# Altium project PCB_Project_3.PrjPcb
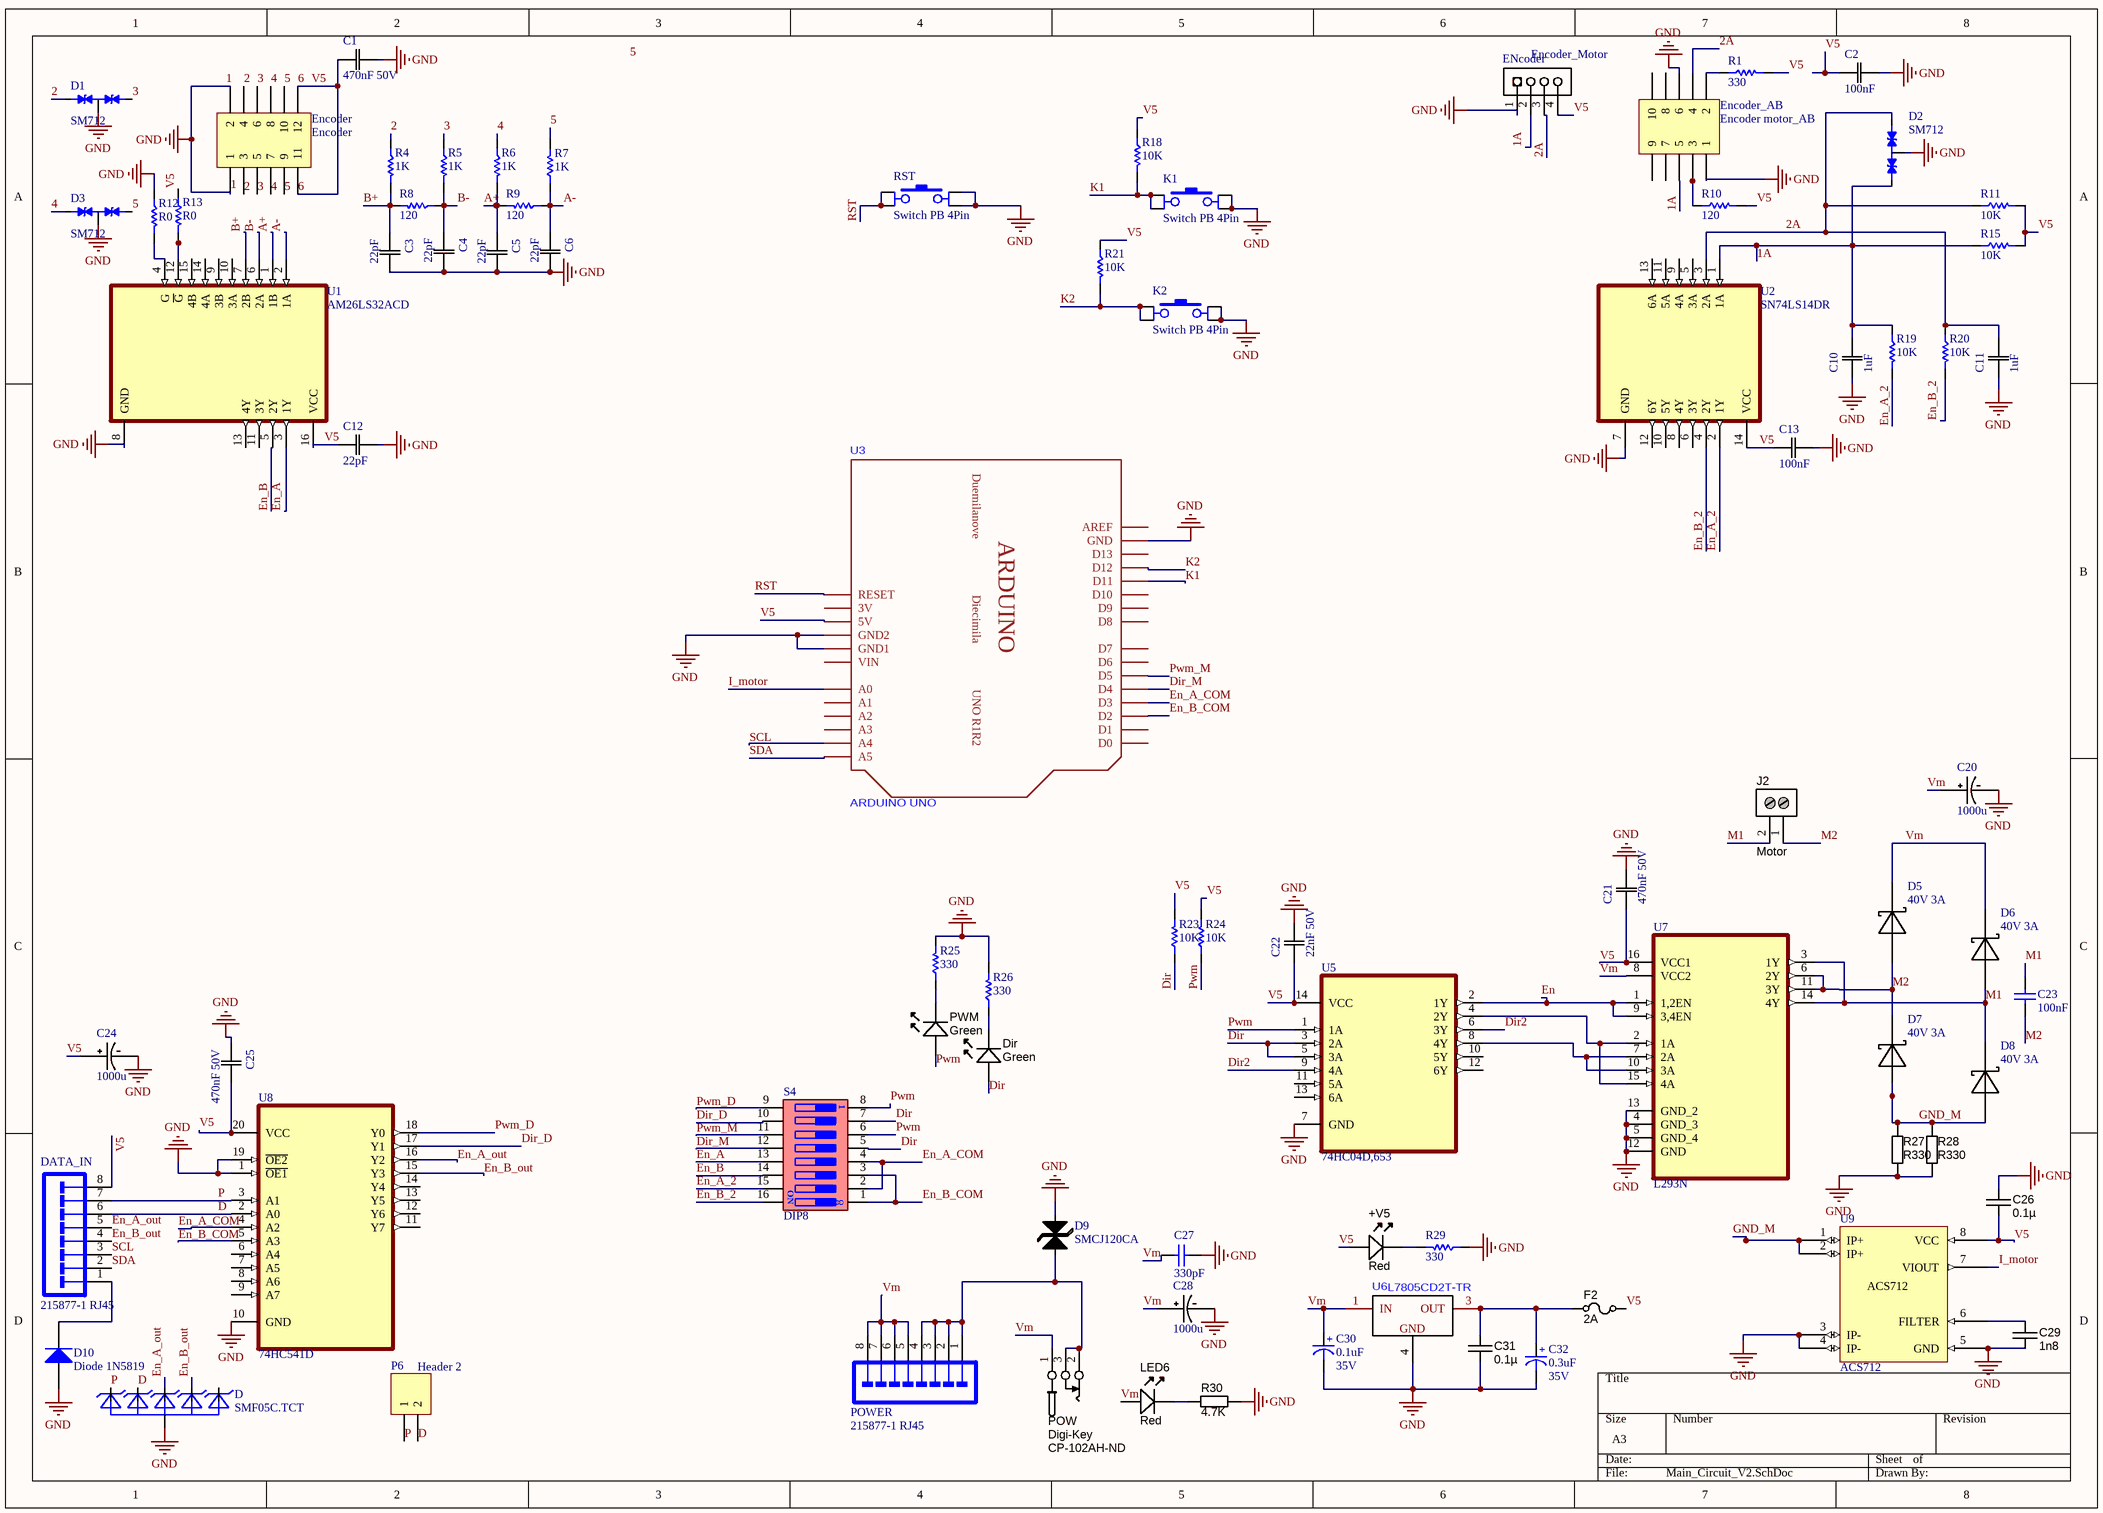
[diagram p0: Main_Circuit_V2.SchDoc]
1 sheet, 82 parts. Net scope: global (net labels, ports and power ports of the same name join across sheets).
Board file: PCB1_V2.PcbDoc

## Sheet Main_Circuit_V2.SchDoc
size A3

### Parts
(Parts that share a designator on the sheet are numbered #1, #2 ... from top to bottom, then left to right.)
+V5  Color: Red  [LED-0805-K]
C1  470nF 50V  [0805]
C2  100nF  [0805]
C3  22pF  [0805]
C4  22pF  [0805]
C5  22pF  [0805]
C6  22pF  [0805]
C10  1uF  [0805]
C11  1uF  [0805]
C12  22pF  [0805]
C13  100nF  [0805]
C20  1000u  [RADIAL - THRU 5mm]
C21  470nF 50V  [0805]
C22  22nF 50V  [0805]
C23  100nF  [CAP Ceramic 3.5mm]
C24  1000u  [RADIAL - THRU 5mm]
C25  470nF 50V  [0805]
C26  value 0.1µ  [CAPC2012X135N]  (hidden comment: approved sub OK)
C27  330pF  [CAP Ceramic 3.5mm]
C28  1000u  [RADIAL - THRU 5mm]
C29  value 1n8  [CAPC2012X135N]  (hidden comment: approved sub OK)
C30  Voltage: 35V  [CAPR5-4X5]  (hidden comment: 0.1uF)
C31  value 0.1µ  [CAPC2012X135N]  (hidden comment: approved sub OK)
C32  Voltage: 35V  [cap 00]  (hidden comment: 0.3uF)
D  SMF05C.TCT  [SC70-6]
D1  SM712  [PCBComponent_1]
D2  SM712  [PCBComponent_1]
D3  SM712  [PCBComponent_1]
D5  40V 3A  [DO-214AC]
D6  40V 3A  [DO-214AC]
D7  40V 3A  [DO-214AC]
D8  40V 3A  [DO-214AC]
D9  SMCJ120CA  [DIODE-SMC]
D10  Diode 1N5819  [DO-214AC]
DATA_IN  215877-1 RJ45  [rj45]
Dir  Color: Green  [LED-0805-K]
ENcoder#1  Encoder_Motor  [HEADER-1X4]
Encoder#2  Encoder  [HDR2X6]
Encoder_AB  Encoder motor_AB  [hhh]
F2  value 2A  [RESC3216X70N]  (hidden comment: Slow-blow)
J2  Supplier Part Number 1: Motor  [2P_PCB_ScrewTerm_90S_3.81MM]  (hidden comment: Stackable ScrewTerm)
K1  Switch PB 4Pin  [SW_PB_THT_4PIN_SPDT_6X6X7]
K2  Switch PB 4Pin  [SW_PB_THT_4PIN_SPDT_6X6X7]
LED6  Color: Red  [LED-0805-K]
P6  Header 2  [HDR1X2]
POW  Supplier 1: Digi-Key  Supplier Part Number 1: CP-102AH-ND  [CONN_PWR_JACK_2.1x5.5mm]  (hidden comment: CONN_PWR_JACK_2.1x5.5mm)
POWER  215877-1 RJ45  [rj45]
PWM  Color: Green  [LED-0805-K]
R1  330  [0805]
R4  1K  [0805]
R5  1K  [0805]
R6  1K  [0805]
R7  1K  [0805]
R8  120  [0805]
R9  120  [0805]
R10  120  [0805]
R11  10K  [0805]
R12  R0  [0805]
R13  R0  [0805]
R15  10K  [0805]
R18  10K  [0805]
R19  10K  [0805]
R20  10K  [0805]
R21  10K  [0805]
R23  10K  [0805]
R24  10K  [0805]
R25  330  [0805]
R26  330  [0805]
R27  value R330  [RESC6332X70N]  (hidden comment: Thick Film)
R28  value R330  [RESC6332X70N]  (hidden comment: Thick Film)
R29  330  [0805]
R30  value 4.7K  [RESC3216X70N]  (hidden comment: Thin Film)
RST  Switch PB 4Pin  [SW_PB_THT_4PIN_SPDT_6X6X7]
S4  DIP8  [DIP Switch x8]
U1  AM26LS32ACD  [SOIC127P600X175-16N]
U2  SN74LS14DR  [SOIC127P600X175-14N]
U3  ARDUINO UNO  [Ardu_Uno]
U5  74HC04D,653  [SOIC127P600X175-14N]
U6  L7805CD2T-TR  [TO-252]
U7  L293N  [DIP254P762X508-16]
U8  74HC541D  [SOIC20-1]
U9  ACS712  [ACS712]

### Nets
1: C1.2(C2) C2.2(C2) C3.2(C2) C4.2(C2) C5.2(C2) C6.2(C2) C10.1(C1) C11.1(C1) C12.2(C2) C13.2(C2) C20.NEG C21.2(C2) C22.2(C2) C24.NEG C25.1(C1) C26.1 C27.1 C28.NEG C29.2 C30.2(-) C31.2 C32.2(-) D.2(A) D1.3 D2.3 D3.3 D9.K D10.1(A) ENcoder#1.1 Encoder#2.1 Encoder#2.2 Encoder_AB.1 Encoder_AB.6 K1.3(PINB2) K1.4(PINB1) K2.3(PINB2) K2.4(PINB1) R12.1 R25.2 R26.2 R27.2 R28.2 R29.1 R30.2 RST.3(PINB2) RST.4(PINB1) U1.8(GND) U2.7(GND) U3.GND U3.GND1 U3.GND2 U5.7(GND) U6.4(GND) U7.4(GND_3) U7.5(GND_4) U7.12(GND) U7.13(GND_2) U8.1(~{OE1}) U8.10(GND) U8.19(~{OE2}) U9.3(IP-) U9.4(IP-) U9.5(GND)  [also labelled GND]
1A: C10.2(C2) D2.2 ENcoder#1.2 Encoder_AB.5 R15.1 R19.1 U2.1(1A)
2: D1.2 Encoder#2.3 Encoder#2.4 R4.1
2A: C11.2(C2) D2.1 ENcoder#1.3 Encoder_AB.4 R11.1 R20.1 U2.3(2A)
3: D1.1 Encoder#2.5 Encoder#2.6 R5.1
4: D3.2 Encoder#2.7 Encoder#2.8 R6.1
5: D3.1 Encoder#2.9 Encoder#2.10 R7.2
6: +V5.A C1.1(C1) C2.1(C1) C12.1(C1) C13.1(C1) C21.1(C1) C22.1(C1) C24.POS C25.2(C2) C26.2 DATA_IN.8 ENcoder#1.4 Encoder#2.11 Encoder#2.12 F2.2 R1.2 R10.2 R13.1 R18.1 R21.1 R23.2 R24.2 U1.16(VCC) U2.14(VCC) U3.5V U5.14(VCC) U7.16(VCC1) U8.20(VCC) U9.8(VCC)  [also labelled V5]
A+: C5.1(C1) R6.2 R9.2 U1.1(1B)
A-: C6.1(C1) R7.1 R9.1 U1.2(1A)
B+: C3.1(C1) R4.2 R8.2 U1.7(2B)
B-: C4.1(C1) R5.2 R8.1 U1.6(2A)
D: D.3(C2) DATA_IN.6 P6.2 U8.2(A0)
Dir: Dir.A R23.1 S4.5 S4.7 U5.3(2A) U5.5(3A)
Dir2: U5.6(3Y) U5.9(4A)
Dir_D: S4.10 U8.17(Y1)
Dir_M: S4.12 U3.D4
En: U5.2(1Y) U7.1(1,2EN) U7.9(3,4EN)
En_A: S4.13 U1.3(1Y)
En_A_2: R19.2 S4.15 U2.2(1Y)
En_A_COM: S4.2 S4.4 U3.D3 U8.4(A2)
En_A_out: D.4(C3) DATA_IN.5 U8.16(Y2)
En_B: S4.14 U1.5(2Y)
En_B_2: R20.2 S4.16 U2.4(2Y)
En_B_COM: S4.1 S4.3 U3.D2 U8.5(A3)
En_B_out: D.5(C4) DATA_IN.4 U8.15(Y3)
GND_M: D7.A D8.A R27.1 R28.1 U9.1(IP+) U9.2(IP+)
I_motor: U3.A0 U9.7(VIOUT)
K1: K1.1(PINA1) K1.2(PINA2) R18.2 U3.D11
K2: K2.1(PINA1) K2.2(PINA2) R21.2 U3.D12
M1: C23.2 D6.A D8.C(K) J2.2 U7.3(1Y) U7.14(4Y)
M2: C23.1 D5.A D7.C(K) J2.1 U7.6(2Y) U7.11(3Y)
P: D.1(C1) DATA_IN.7 P6.1 U8.3(A1)
Pwm: PWM.A R24.1 S4.6 S4.8 U5.1(1A)
Pwm_D: S4.9 U8.18(Y0)
Pwm_M: S4.11 U3.D5
RST: RST.1(PINA1) RST.2(PINA2) U3.RESET
SCL: DATA_IN.3 U3.A4
SDA: DATA_IN.2 U3.A5
Vm: C20.POS C27.2 C28.POS C30.1(+) D5.C(K) D6.C(K) LED6.A POW.1 POWER.5 POWER.6 POWER.7 POWER.8 U6.1(IN) U7.8(VCC2)
Net+V5_K: +V5.K R29.2
NetC29_1: C29.1 U9.6(FILTER)
NetC31_1: C31.1 C32.1(+) F2.1 U6.3(OUT)
NetD9_A: D9.A POW.2 POW.3 POWER.1 POWER.2 POWER.3 POWER.4
NetD10_2: D10.2(K) DATA_IN.1
NetDir_K: Dir.K R26.1
NetEncoder_AB_2: Encoder_AB.2 R1.1
NetEncoder_AB_3: Encoder_AB.3 R10.1
NetLED6_K: LED6.K R30.1
NetPWM_K: PWM.K R25.1
NetR12_2: R12.2 U1.4(G)
NetR13_2: R13.2 U1.12(~{G})
NetU5_4: U5.4(2Y) U7.2(1A) U7.15(4A)
NetU5_8: U5.8(4Y) U7.7(2A) U7.10(3A)

Not connected (* = marked no-connect by the designer): D 6(C5); Encoder_AB 7 8 9 10; R11 2; R15 2; U1 9(3B) 10(3A) 11(3Y) 13(4Y) 14(4A) 15(4B); U2 5(3A) 6(3Y) 8(4Y) 9(4A) 10(5Y) 11(5A) 12(6Y) 13(6A); U3 3V A1 A2 A3 AREF D0 D1 D6 D7 D8 D9 D10 D13 VIN; U5 10(5Y) 11(5A) 12(6Y) 13(6A); U8 6(A4) 7(A5) 8(A6) 9(A7) 11(Y7) 12(Y6) 13(Y5) 14(Y4)

### Notes on the sheet
- Labels drawn without touching a wire or pin: 5
- (in symbol ARDUINO UNO) Duemilanove; ARDUINO; Diecimila; UNO R1R2
- (in symbol DIP Switch 8) ON

### Library data of the parts
+V5 = LED_SMD_Red_0805_6mcd: LED 0805 SMD Red 6mcd 621nm; Manufacturer 1: Lite-On Inc; Manufacturer Part Number 1: LTST-C171EKT; Ratings: 6 mcd; 621 nm; SCDType: source; Package / Case: 0805; Material: GaAsP on GaP; Supplier 1: Digi-Key; Supplier Part Number 1: 160-1422-1-ND; Value: Red
C1 C21 C25 = CAP 470nF 50V: CAP CER 0.1UF 50V X7R 0805; Tolerance: 10%; Package: 0805; Value: 470nF; Rating: 50V
C2-C6 C10-C13 C22 = CAP 470nF 50V: CAP CER 0.1UF 50V X7R 0805; Value: 470nF; Tolerance: 10%; Package: 0805; Rating: 50V
C20 C24 C28 = CAP POL 1000uF TH: NICHICON   UVR1E102MPD1TD   ALUMINUM ELECTROLYTIC CAPACITOR, 1000UF, 25V, 20%, RADIAL, FULL REEL; Dielectric Material: Aluminium; Life (Hours): 2000Hour; Capacitance: 1mF; Leakage Current: 750uA; Dissipation Factor: 0.16%; Ripple Current: 960mA; Lead Diameter: 0.6mm; Supplier 1: Digi-Key; Manufacturer: Nichicon; Manufacturer Part Number: UVR1E102MPD1TD; RoHS: Yes; Category: Aluminum Electrolytic Capacitors; Stock 1: 43448; Pricing 1: 1=0.58000, 10=0.40800, 100=0.26890 (USD); Mount: Through Hole,PCB; Case/Package: Radial; Number of Pins: 2; Min Operating Temperature: -40°C; Max Operating Temperature: 85°C; Packaging: Tape and Reel; Tolerance: 20%; Voltage Rating (DC): 25V; Voltage Rating: 25V; Termination: Radial; Voltage: 25V; Package Quantity: 500; Diameter: 10mm; Length: 20mm; Height: 20mm; Height - Seated (Max): 0.866inch; Lead Pitch: 5mm; Radiation Hardening: No; REACH SVHC: No SVHC; Lead Free: Lead Free; ComponentLink1URL: https://datasheet.ciiva.com/7851/e-vr-7851718.pdf?src-supplier=Element14; ComponentLink1Description: https://datasheet.ciiva.com/7851/e-vr-7851718.pdf?src-supplier=Element14; ComponentLink2URL: https://datasheet.ciiva.com/6300/e-vr-6300009.pdf?src-supplier=Digi-Key; ComponentLink2Description: https://datasheet.ciiva.com/6300/e-vr-6300009.pdf?src-supplier=Digi-Key; ComponentLink3URL: https://datasheet.ciiva.com/6300/e-vr-6300010.pdf?src-supplier=Digi-Key; ComponentLink3Description: https://datasheet.ciiva.com/6300/e-vr-6300010.pdf?src-supplier=Digi-Key; ComponentLink4URL: https://datasheet.ciiva.com/11684/e-vr-11684106.pdf?src-supplier=Avnet; ComponentLink4Description: https://datasheet.ciiva.com/11684/e-vr-11684106.pdf?src-supplier=Avnet; ComponentLink5URL: https://datasheet.ciiva.com/16502/e-vr-16502813.pdf?src-supplier=Future+Electronics; ComponentLink5Description: https://datasheet.ciiva.com/16502/e-vr-16502813.pdf?src-supplier=Future+Electronics; ComponentLink6URL: https://datasheet.ciiva.com/46381/1909356-46381757.pdf?src-supplier=Element14; ComponentLink6Description: https://datasheet.ciiva.com/46381/1909356-46381757.pdf?src-supplier=Element14; Supplier Part Number 1: 493-5913-1-ND
C23 C27 = CAP CERAMIC TOTAL SIZE: CAP Ceramic Total; Designer: Ali Hafizi
C26 C31 = CAPC_1u_0805_X7R_16V_10%: Capacitor SMD Cer 1uF 10% 16V X7R 0805; Manufacturer 1: Yageo; Manufacturer Part Number 1: CC0805KKX7R7BB105; Ratings: 16V; X7R; Material: ceramic; SCDType: spec; Package / Case: 0805 (2012 metric); Tolerance: ±10%; Supplier 1: Digi-Key; Supplier Part Number 1: 311-1365-6-ND; RoHS 1: RoHS Compliant; Temperature Coefficient: X7R; ComponentLink1URL: http://www.yageo.com/documents/recent/UPY-GPHC_X7R_6.3V-to-50V_8.pdf; ComponentLink1Description: http://www.yageo.com/documents/recent/UPY-GPHC_X7R_6.3V-to-50V_8.pdf; Supplier 2: Digi-Key; Supplier Part Number 2: 399-1284-6-ND; Manufacturer 2: Kemet; Manufacturer Part Number 2: C0805C105K4RACTU; RoHS 2: RoHS Compliant; ComponentLink2URL: http://www.kemet.com/datasheets&C0805C105K4RACTU; ComponentLink2Description: http://www.kemet.com/datasheets&C0805C105K4RACTU; Supplier 3: Digi-Key; Supplier Part Number 3: 1276-1026-6-ND; Manufacturer 3: Samsung Electro-Mechanics America, Inc; Manufacturer Part Number 3: CL21B105KOFNNNE; RoHS 3: RoHS Compliant; ComponentLink3URL: http://www.samsungsem.com/servlet/FileDownload?type=spec&file=CL21B105KOFNNNE.pdf; ComponentLink3Description: http://www.samsungsem.com/servlet/FileDownload?type=spec&file=CL21B105KOFNNNE.pdf; Supplier 4: Digi-Key; Supplier Part Number 4: 445-1358-6-ND; Manufacturer 4: TDK Corporation; Manufacturer Part Number 4: C2012X7R1C105K125AA; RoHS 4: RoHS Compliant; ComponentLink4URL: http://product.tdk.com/capacitor/mlcc/en/documents/mlcc_commercial_general_en.pdf; ComponentLink4Description: http://product.tdk.com/capacitor/mlcc/en/documents/mlcc_commercial_general_en.pdf
C29 = CAPC_1n8_50V_0805: Capacitor SMD Cer 1.8nF 10% 50V X7R 0805; Manufacturer 1: AVX Corporation; Manufacturer Part Number 1: 08055C182KAT2A; Ratings: 50V; X7R; SCDType: source*; Tolerance: ±10%; Operating Temperature: -55°C ~ 125°C; Package / Case: 0805 (2012 metric); Supplier 1: Digi-Key; Supplier Part Number 1: 478-1374-1-ND
C30 C32 = Cap-Polar: Polar Capacitor; Designer: Saeid Jorablo; Organazation: ControTec; Adding Date: 1387/12/20
  C30: Value: 0.1uF
  C32: Value: 0.3uF
D = SMF05C.TCT: 12.5V Clamp 8A _8/20Âµs_ Ipp Tvs Diode Surface Mount SC-70-6; MF: Semtech; Price: None; Value: *; MP: SMF05C.TCT; Package: SOT-363 Diodes Inc.; SnapEDA_Link: https://www.snapeda.com/parts/SMF05C.TCT/Semtech%20Corporation/view-part/1264306/?ref=snap; Availability: Unavailable
D1-D3 = SM712.TC: Asymmetrical TVS Diode for  Extended Common-Mode RS-485; Manufacturer: SEMTECH; Link to Datasheet: *; Link to Picture: *; Operating Temp: -55 to 125 °C; Storage Temp: -55 to 150 °C; ComponentLink1Description: *; ComponentLink1URL: *; Manufacture Part #: SM712.TC; Value: SM712
D5-D8 = DIODE SCHOTTKY 40V 3A: Diode Schottky 40V 3A Surface Mount SMA; Voltage - Forward (Vf) (Max) @ If: 450mV @ 3A; ComponentLink1Description: digikey; ComponentLink1URL: https://www.digikey.ca/product-detail/en/on-semiconductor/MBR0540T1G/MBR0540T1GOSCT-ND/917967; Voltage - DC Reverse (Vr) (Max): 40V; Package: DO-214AC; Current - Average Rectified (Io): 3A
D9 = SMCJ120CA: Transient Surpression Diode TVS; Supplier 1: Digi-Key; Supplier Part Number 1: SMCJ120CABTR-ND
D10 = Diode 1N5819: SS14; ComponentLink1Description: Manufacturer Link; ComponentLink1URL: http://www.irf.com/
DATA_IN POWER = 215877-1 RJ45: Female Header, Pitch 2.54 mm, 2 x 4 Position, Height 11.5 mm, Tail Length 3 mm, -40 to 105 degC, RoHS, Tape and Reel; Dynamic Catalog: Modular Jacks; Other Names: A105009CT; Number of Ports: 1; Connector Type: Jack; LED Color: Does Not Contain LED; Ratings: Cat3; Number of Positions/Contacts: 8p8c (RJ45, Ethernet); 3D Model: 215877-1.pdf; Tab Direction: Down; Shielding: Unshielded; DatasheetVersion: Rev. AE; PackageReference: THD; Supplier 1: Digi-Key; Supplier Part Number 1: A105009TR-ND; Supplier 2: Digi-Key; Supplier Part Number 2: A105009CT-ND; Features: Board Lock; Packaging: Cut Tape (CT); Termination: Solder; Family: Modular Connectors - Jacks; Contact Finish: Gold; Housing Material: Polybutylene Terephthalate (PBT); RoHS Information: 215877-1 Statement of Compliance; Mounting Type: Through Hole; Contact Material: Phosphor Bronze; Orientation: 90° Angle (Right); Standard Package: 1; Number of Rows: 1; Category: Connectors, Interconnects; ComponentLink1Description: Manufacturer URL; ComponentLink1URL: http://www.te.com; ComponentLink2Description: Datasheet; ComponentLink2URL: https://datasheet.ciiva.com/16310/215877-1-16310656.pdf
Dir PWM = LED_SMD_Green_0805_6mcd: LED, 0805 SMD, Green; Manufacturer 1: LITE-ON; Manufacturer Part Number 1: LTST-C171GKT; Ratings: 6 mcd; 569 nm; SCDType: source; Package / Case: 0805; Material: GaP; Supplier 1: Digi-Key; Supplier Part Number 1: 160-1423-1-ND; Value: Green
ENcoder#1 = HEADER-1X4: Supplier 1: Digi-Key; Supplier Part Number 1: S1011E-36-ND
Encoder#2 = Header 6X2: Header, 6-Pin, Dual row; LatestRevisionDate: 17-Jul-2002; LatestRevisionNote: Re-released for DXP Platform.; Publisher: Altium Limited
Encoder_AB = Header 5X2: Header, 5-Pin, Dual row; LatestRevisionDate: 17-Jul-2002; LatestRevisionNote: Re-released for DXP Platform.; Publisher: Altium Limited
F2 = FUSE_160mA_1206: Fuse 160mA 63VDC 1206 SMD; Manufacturer 1: Holly Fuse; Manufacturer Part Number 1: 12T-0160L; Ratings: 160mA; 63VDC; slow-blow; SCDType: spec; Package / Case: 1206 (3216 metric)
J2 = 2P_ScrewTerm_90S_3.81MM: Terminal Block Screw Type THT 2-Position 3.81mm pitch; Manufacturer 1: Tyco Electronics; Manufacturer Part Number 1: 1776113-2; Value: 2 position; Pitch: 0.150" (3.81mm); Positions Per Level: 2; SCDType: undef; Package / Case: Side Entry; 3.81mm pitch; Category: Connectors Interconnects; Color: Black; Supplier 1: Digi-Key
K1 K2 RST = SW-PB-4Pin: Switch Push Button 4 Pin
LED6 = LED_SMD_Red_0805_6mcd: LED 0805 SMD Red 6mcd 621nm; Manufacturer 1: Lite-On Inc; Manufacturer Part Number 1: LTST-C171EKT; Material: GaAsP on GaP; Ratings: 6 mcd; 621 nm; SCDType: source; Package / Case: 0805; Supplier 1: Digi-Key; Supplier Part Number 1: 160-1422-1-ND; Value: Red
P6 = Header 2: Header, 2-Pin; LatestRevisionDate: 17-Jul-2002; LatestRevisionNote: Re-released for DXP Platform.; Publisher: Altium Limited
POW = CONN_PWR_JACK_2.1x5.5mm: Power Connector, THT, 2.1mm ID, 5.5mm OD; Manufacturer 1: CUI Inc; Manufacturer Part Number 1: PJ-102AH; SCDType: undef; Category: Connectors; Mounting Type: Through Hole; Package / Case: PCB mount; Value: 2.1mm ID, 5.5mm OD
R1 R4-R13 R15 R18-R21 R23-R26 R29 = Resistor: Tolerance: 5%; Power: 1/8 W
  R1 R25 R26 R29: Value: 330
  R4-R7: Value: 1K
  R8-R10: Value: 120
  R11 R15 R18-R21 R23 R24: Value: 10K
  R12 R13: Value: R0
R27 R28 = RES_3K3_2512_5%: Resistor SMD chip 3.3k Ohm 1W 5% 2512; Manufacturer 1: Vishay/Dale; Manufacturer Part Number 1: CRCW25123K30JNEG; SCDType: spec; Tolerance: ±5%; Ratings: 1W; Material: Thick Film; Supplier 1: Digi-Key; Supplier Part Number 1: 541-3.3KXCT-ND; Package / Case: 2512 (6332 metric)
R30 = RES_91R_1206_5%: Resistor SMD chip 91 Ohm 0.25W 5% 1206; Manufacturer 1: Yageo; Manufacturer Part Number 1: RC1206JR-0791RL; Ratings: 1/4 W; SCDType: spec; Package / Case: 1206 (3216 Metric); Tolerance: ±5%; Material: Thin Film; Supplier 1: Digi-Key; Supplier Part Number 1: 311-91ERCT-ND; ComponentLink1URL: http://www.yageo.com/documents/recent/PYu-RC1206_51_RoHS_L_4.pdf; ComponentLink1Description: http://www.yageo.com/documents/recent/PYu-RC1206_51_RoHS_L_4.pdf
S4 = DIP Switch 8: 8 BIT DIP Switch
U1 = AM26LS32ACD: Quadruple Differential Line Receivers 16-SOIC 0 to 70; MF: Texas Instruments; Value: *; Package: SOIC-16 Texas Instruments; Purchase-URL: https://pricing.snapeda.com/search/part/AM26LS32ACD/?ref=eda; Price: None; MP: AM26LS32ACD; SnapEDA_Link: https://www.snapeda.com/parts/AM26LS32ACD/Texas%20Instruments/view-part/288238/?ref=snap; Availability: Good; Check_prices: https://www.snapeda.com/parts/AM26LS32ACD/Texas%20Instruments/view-part/288238/?ref=eda
U5 = 74HC04D,653: Inverter IC 6 Channel 14-SO; MF: Nexperia USA; Price: None; Availability: Good; Package: SO14-14 Nexperia USA Inc.; MP: 74HC04D,653; Value: *; SnapEDA_Link: https://www.snapeda.com/parts/74HC04D,653/Nexperia/view-part/1784153/?ref=snap; Purchase-URL: https://pricing.snapeda.com/search/part/74HC04D,653/?ref=eda; Check_prices: https://www.snapeda.com/parts/74HC04D,653/Nexperia/view-part/1784153/?ref=eda
U7 = L293N: Bipolar Motor Driver Bipolar Parallel 16-PDIP; MF: Texas Instruments; Availability: Unavailable; MP: L293N; Package: PDIP-16 Texas Instruments; SnapEDA_Link: https://www.snapeda.com/parts/L293N/Texas%20Instruments/view-part/4503258/?ref=snap; Value: *; Price: None
U8 = 74HC541D: Buffer, Non-Inverting 1 Element 8 Bit per Element 3-State Output 20-SOIC; MF: Toshiba Semiconductor; Price: None; Availability: Unavailable; SnapEDA_Link: https://www.snapeda.com/parts/74HC541D/Toshiba%20Semiconductor%20and%20Storage/view-part/2887736/?ref=snap; Value: *; Package: SOIC-20 Toshiba; MP: 74HC541D
U2 = SN74LS14DR: Package: None; Price: None; Value: *; MP: SN74LS14DR; Availability: Unavailable